# Altium schematic sheet analog_osc_front_end.SchDoc
size A3
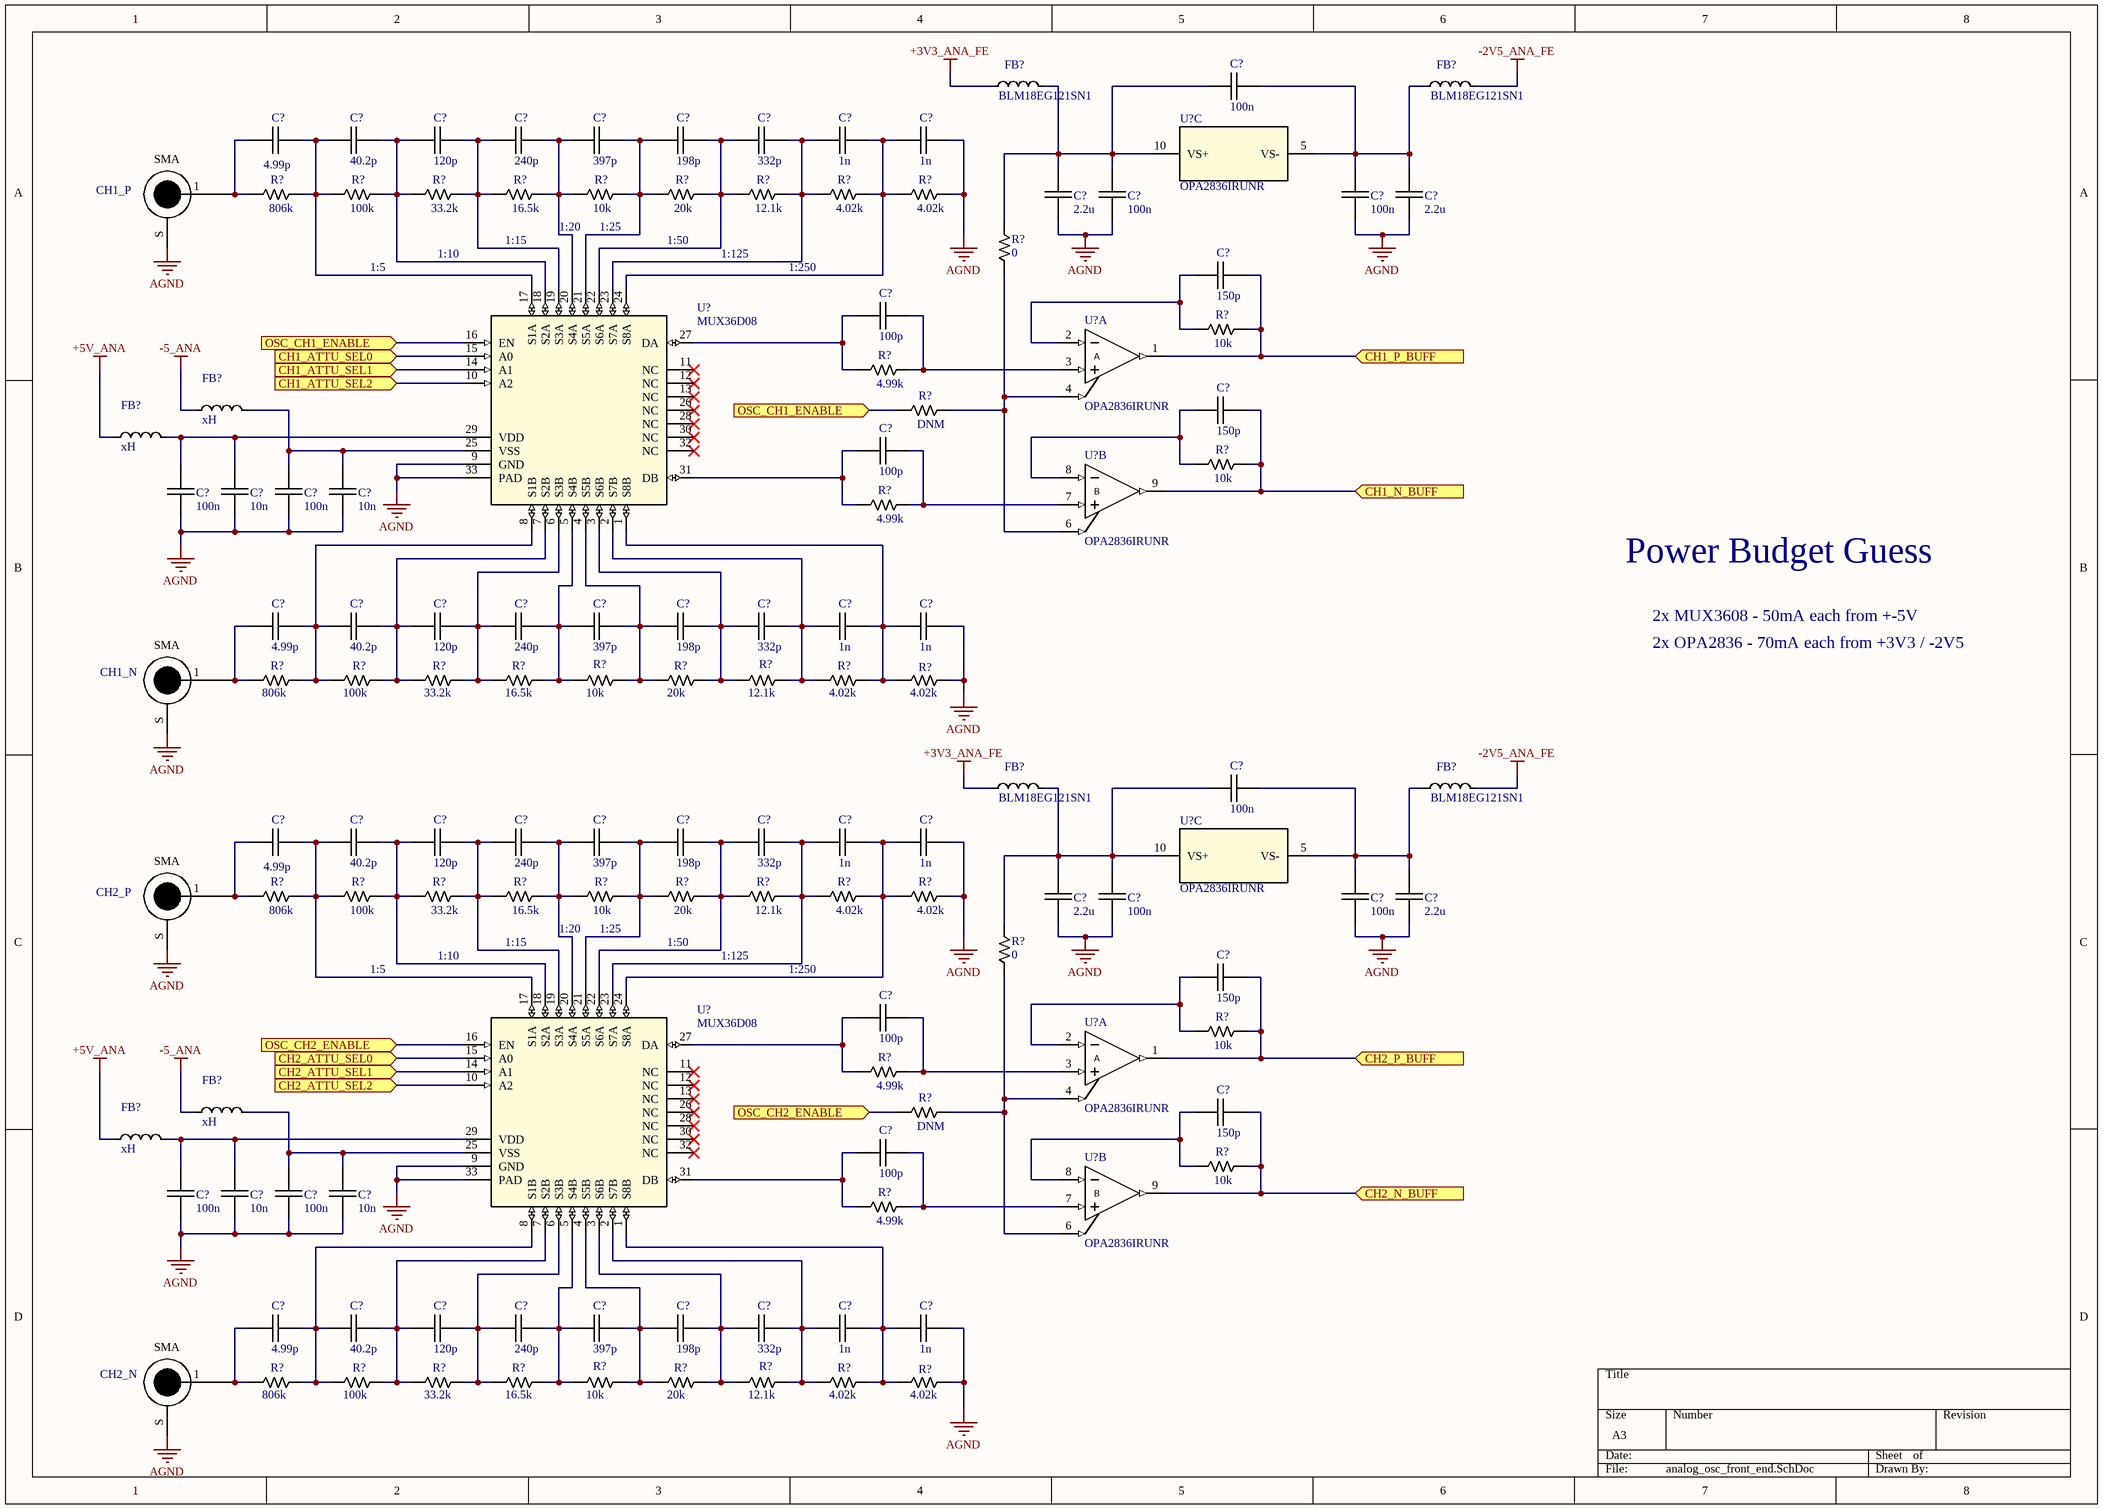
[diagram p0: analog_osc_front_end.SchDoc]

## Parts
(Parts that share a designator on the sheet are numbered #1, #2 ... from top to bottom, then left to right.)
C?#1  value 100n  [CAPC1005X06N]  (hidden comment: MLLC Capacitor)
C?#2  value 4.99p  [CAPC1005X06N]  (hidden comment: MLLC Capacitor)
C?#3  value 40.2p  [CAPC1005X06N]  (hidden comment: MLLC Capacitor)
C?#4  value 120p  [CAPC1005X06N]  (hidden comment: MLLC Capacitor)
C?#5  value 240p  [CAPC1005X06N]  (hidden comment: MLLC Capacitor)
C?#6  value 397p  [CAPC1005X06N]  (hidden comment: MLLC Capacitor)
C?#7  value 198p  [CAPC1005X06N]  (hidden comment: MLLC Capacitor)
C?#8  value 332p  [CAPC1005X06N]  (hidden comment: MLLC Capacitor)
C?#9  value 1n  [CAPC1005X06N]  (hidden comment: MLLC Capacitor)
C?#10  value 1n  [CAPC1005X06N]  (hidden comment: MLLC Capacitor)
C?#11  value 2.2u  [CAPC1005X06N]  (hidden comment: MLLC Capacitor)
C?#12  value 100n  [CAPC1005X06N]  (hidden comment: MLLC Capacitor)
C?#13  value 100n  [CAPC1005X06N]  (hidden comment: MLLC Capacitor)
C?#14  value 2.2u  [CAPC1005X06N]  (hidden comment: MLLC Capacitor)
C?#15  value 150p  [CAPC1005X06N]  (hidden comment: MLLC Capacitor)
C?#16  value 100p  [CAPC1005X06N]  (hidden comment: MLLC Capacitor)
C?#17  value 150p  [CAPC1005X06N]  (hidden comment: MLLC Capacitor)
C?#18  value 100p  [CAPC1005X06N]  (hidden comment: MLLC Capacitor)
C?#19  value 100n  [CAPC1005X06N]  (hidden comment: MLLC Capacitor)
C?#20  value 10n  [CAPC1005X06N]  (hidden comment: MLLC Capacitor)
C?#21  value 100n  [CAPC1005X06N]  (hidden comment: MLLC Capacitor)
C?#22  value 10n  [CAPC1005X06N]  (hidden comment: MLLC Capacitor)
C?#23  value 4.99p  [CAPC1005X06N]  (hidden comment: MLLC Capacitor)
C?#24  value 40.2p  [CAPC1005X06N]  (hidden comment: MLLC Capacitor)
C?#25  value 120p  [CAPC1005X06N]  (hidden comment: MLLC Capacitor)
C?#26  value 240p  [CAPC1005X06N]  (hidden comment: MLLC Capacitor)
C?#27  value 397p  [CAPC1005X06N]  (hidden comment: MLLC Capacitor)
C?#28  value 198p  [CAPC1005X06N]  (hidden comment: MLLC Capacitor)
C?#29  value 332p  [CAPC1005X06N]  (hidden comment: MLLC Capacitor)
C?#30  value 1n  [CAPC1005X06N]  (hidden comment: MLLC Capacitor)
C?#31  value 1n  [CAPC1005X06N]  (hidden comment: MLLC Capacitor)
C?#32  value 100n  [CAPC1005X06N]  (hidden comment: MLLC Capacitor)
C?#33  value 4.99p  [CAPC1005X06N]  (hidden comment: MLLC Capacitor)
C?#34  value 40.2p  [CAPC1005X06N]  (hidden comment: MLLC Capacitor)
C?#35  value 120p  [CAPC1005X06N]  (hidden comment: MLLC Capacitor)
C?#36  value 240p  [CAPC1005X06N]  (hidden comment: MLLC Capacitor)
C?#37  value 397p  [CAPC1005X06N]  (hidden comment: MLLC Capacitor)
C?#38  value 198p  [CAPC1005X06N]  (hidden comment: MLLC Capacitor)
C?#39  value 332p  [CAPC1005X06N]  (hidden comment: MLLC Capacitor)
C?#40  value 1n  [CAPC1005X06N]  (hidden comment: MLLC Capacitor)
C?#41  value 1n  [CAPC1005X06N]  (hidden comment: MLLC Capacitor)
C?#42  value 2.2u  [CAPC1005X06N]  (hidden comment: MLLC Capacitor)
C?#43  value 100n  [CAPC1005X06N]  (hidden comment: MLLC Capacitor)
C?#44  value 100n  [CAPC1005X06N]  (hidden comment: MLLC Capacitor)
C?#45  value 2.2u  [CAPC1005X06N]  (hidden comment: MLLC Capacitor)
C?#46  value 150p  [CAPC1005X06N]  (hidden comment: MLLC Capacitor)
C?#47  value 100p  [CAPC1005X06N]  (hidden comment: MLLC Capacitor)
C?#48  value 150p  [CAPC1005X06N]  (hidden comment: MLLC Capacitor)
C?#49  value 100p  [CAPC1005X06N]  (hidden comment: MLLC Capacitor)
C?#50  value 100n  [CAPC1005X06N]  (hidden comment: MLLC Capacitor)
C?#51  value 10n  [CAPC1005X06N]  (hidden comment: MLLC Capacitor)
C?#52  value 100n  [CAPC1005X06N]  (hidden comment: MLLC Capacitor)
C?#53  value 10n  [CAPC1005X06N]  (hidden comment: MLLC Capacitor)
C?#54  value 4.99p  [CAPC1005X06N]  (hidden comment: MLLC Capacitor)
C?#55  value 40.2p  [CAPC1005X06N]  (hidden comment: MLLC Capacitor)
C?#56  value 120p  [CAPC1005X06N]  (hidden comment: MLLC Capacitor)
C?#57  value 240p  [CAPC1005X06N]  (hidden comment: MLLC Capacitor)
C?#58  value 397p  [CAPC1005X06N]  (hidden comment: MLLC Capacitor)
C?#59  value 198p  [CAPC1005X06N]  (hidden comment: MLLC Capacitor)
C?#60  value 332p  [CAPC1005X06N]  (hidden comment: MLLC Capacitor)
C?#61  value 1n  [CAPC1005X06N]  (hidden comment: MLLC Capacitor)
C?#62  value 1n  [CAPC1005X06N]  (hidden comment: MLLC Capacitor)
CH1_N  SMA Edge  [SMA_EDGE]  (value not drawn)
CH1_P  SMA Edge  [SMA_EDGE]  (value not drawn)
CH2_N  SMA Edge  [SMA_EDGE]  (value not drawn)
CH2_P  SMA Edge  [SMA_EDGE]  (value not drawn)
FB?#1  value BLM18EG121SN1  [INDC1608X08N]  (hidden comment: Chip Inductor)
FB?#2  value BLM18EG121SN1  [INDC1608X08N]  (hidden comment: Chip Inductor)
FB?#3  value xH  [INDC2016X10N]  (hidden comment: Chip Inductor)
FB?#4  value xH  [INDC2016X10N]  (hidden comment: Chip Inductor)
FB?#5  value BLM18EG121SN1  [INDC1608X08N]  (hidden comment: Chip Inductor)
FB?#6  value BLM18EG121SN1  [INDC1608X08N]  (hidden comment: Chip Inductor)
FB?#7  value xH  [INDC2016X10N]  (hidden comment: Chip Inductor)
FB?#8  value xH  [INDC2016X10N]  (hidden comment: Chip Inductor)
R?#1  value 806k  [RESC1005X04N]  (hidden comment: Chip Resistor)
R?#2  value 100k  [RESC1005X04N]  (hidden comment: Chip Resistor)
R?#3  value 33.2k  [RESC1005X04N]  (hidden comment: Chip Resistor)
R?#4  value 16.5k  [RESC1005X04N]  (hidden comment: Chip Resistor)
R?#5  value 10k  [RESC1005X04N]  (hidden comment: Chip Resistor)
R?#6  value 20k  [RESC1005X04N]  (hidden comment: Chip Resistor)
R?#7  value 12.1k  [RESC1005X04N]  (hidden comment: Chip Resistor)
R?#8  value 4.02k  [RESC1005X04N]  (hidden comment: Chip Resistor)
R?#9  value 4.02k  [RESC1005X04N]  (hidden comment: Chip Resistor)
R?#10  value 0  [RESC1005X04N]  (hidden comment: Chip Resistor)
R?#11  value 10k  [RESC1005X04N]  (hidden comment: Chip Resistor)
R?#12  value 4.99k  [RESC1005X04N]  (hidden comment: Chip Resistor)
R?#13  value DNM  [RESC1005X04N]  (hidden comment: Chip Resistor)
R?#14  value 10k  [RESC1005X04N]  (hidden comment: Chip Resistor)
R?#15  value 4.99k  [RESC1005X04N]  (hidden comment: Chip Resistor)
R?#16  value 806k  [RESC1005X04N]  (hidden comment: Chip Resistor)
R?#17  value 100k  [RESC1005X04N]  (hidden comment: Chip Resistor)
R?#18  value 33.2k  [RESC1005X04N]  (hidden comment: Chip Resistor)
R?#19  value 16.5k  [RESC1005X04N]  (hidden comment: Chip Resistor)
R?#20  value 10k  [RESC1005X04N]  (hidden comment: Chip Resistor)
R?#21  value 20k  [RESC1005X04N]  (hidden comment: Chip Resistor)
R?#22  value 12.1k  [RESC1005X04N]  (hidden comment: Chip Resistor)
R?#23  value 4.02k  [RESC1005X04N]  (hidden comment: Chip Resistor)
R?#24  value 4.02k  [RESC1005X04N]  (hidden comment: Chip Resistor)
R?#25  value 806k  [RESC1005X04N]  (hidden comment: Chip Resistor)
R?#26  value 100k  [RESC1005X04N]  (hidden comment: Chip Resistor)
R?#27  value 33.2k  [RESC1005X04N]  (hidden comment: Chip Resistor)
R?#28  value 16.5k  [RESC1005X04N]  (hidden comment: Chip Resistor)
R?#29  value 10k  [RESC1005X04N]  (hidden comment: Chip Resistor)
R?#30  value 20k  [RESC1005X04N]  (hidden comment: Chip Resistor)
R?#31  value 12.1k  [RESC1005X04N]  (hidden comment: Chip Resistor)
R?#32  value 4.02k  [RESC1005X04N]  (hidden comment: Chip Resistor)
R?#33  value 4.02k  [RESC1005X04N]  (hidden comment: Chip Resistor)
R?#34  value 0  [RESC1005X04N]  (hidden comment: Chip Resistor)
R?#35  value 10k  [RESC1005X04N]  (hidden comment: Chip Resistor)
R?#36  value 4.99k  [RESC1005X04N]  (hidden comment: Chip Resistor)
R?#37  value DNM  [RESC1005X04N]  (hidden comment: Chip Resistor)
R?#38  value 10k  [RESC1005X04N]  (hidden comment: Chip Resistor)
R?#39  value 4.99k  [RESC1005X04N]  (hidden comment: Chip Resistor)
R?#40  value 806k  [RESC1005X04N]  (hidden comment: Chip Resistor)
R?#41  value 100k  [RESC1005X04N]  (hidden comment: Chip Resistor)
R?#42  value 33.2k  [RESC1005X04N]  (hidden comment: Chip Resistor)
R?#43  value 16.5k  [RESC1005X04N]  (hidden comment: Chip Resistor)
R?#44  value 10k  [RESC1005X04N]  (hidden comment: Chip Resistor)
R?#45  value 20k  [RESC1005X04N]  (hidden comment: Chip Resistor)
R?#46  value 12.1k  [RESC1005X04N]  (hidden comment: Chip Resistor)
R?#47  value 4.02k  [RESC1005X04N]  (hidden comment: Chip Resistor)
R?#48  value 4.02k  [RESC1005X04N]  (hidden comment: Chip Resistor)
U?#1  OPA2836IRUNR  [RUN0010A]  (part C of 3)
U?#2  OPA2836IRUNR  [RUN0010A]  (part A of 3)
U?#3  MUX36D08  [RTV0032E]
U?#4  OPA2836IRUNR  [RUN0010A]  (part B of 3)
U?#5  OPA2836IRUNR  [RUN0010A]  (part C of 3)
U?#6  OPA2836IRUNR  [RUN0010A]  (part A of 3)
U?#7  MUX36D08  [RTV0032E]
U?#8  OPA2836IRUNR  [RUN0010A]  (part B of 3)

## Ports
CH1_ATTU_SEL0 (in), CH1_ATTU_SEL1 (in), CH1_ATTU_SEL2 (in), CH1_N_BUFF (in), CH1_P_BUFF (in), CH2_ATTU_SEL0 (in), CH2_ATTU_SEL1 (in), CH2_ATTU_SEL2 (in), CH2_N_BUFF (in), CH2_P_BUFF (in), OSC_CH1_ENABLE (in), OSC_CH2_ENABLE (in)

## Nets
+3V3_ANA_FE: FB?#1.1 FB?#5.1
+5V_ANA: FB?#4.1 FB?#8.1
-2V5_ANA_FE: FB?#2.2 FB?#6.2
-5_ANA: FB?#3.1 FB?#7.1
AGND: C?#10.2 C?#11.1 C?#12.1 C?#13.1 C?#14.1 C?#19.1 C?#20.1 C?#21.1 C?#22.1 C?#31.2 C?#41.2 C?#42.1 C?#43.1 C?#44.1 C?#45.1 C?#50.1 C?#51.1 C?#52.1 C?#53.1 C?#62.2 CH1_N.S CH1_P.S CH2_N.S CH2_P.S R?#9.2 R?#24.2 R?#33.2 R?#48.2 U?#3.9(GND) U?#3.33(PAD) U?#7.9(GND) U?#7.33(PAD)
CH1_ATTU_SEL0: U?#3.15(A0) ; port CH1_ATTU_SEL0
CH1_ATTU_SEL1: U?#3.14(A1) ; port CH1_ATTU_SEL1
CH1_ATTU_SEL2: U?#3.10(A2) ; port CH1_ATTU_SEL2
CH1_N_BUFF: C?#17.2 R?#14.2 U?#4.9(VOUT2) ; port CH1_N_BUFF
CH1_P_BUFF: C?#15.2 R?#11.2 U?#2.1(VOUT1) ; port CH1_P_BUFF
CH2_ATTU_SEL0: U?#7.15(A0) ; port CH2_ATTU_SEL0
CH2_ATTU_SEL1: U?#7.14(A1) ; port CH2_ATTU_SEL1
CH2_ATTU_SEL2: U?#7.10(A2) ; port CH2_ATTU_SEL2
CH2_N_BUFF: C?#48.2 R?#38.2 U?#8.9(VOUT2) ; port CH2_N_BUFF
CH2_P_BUFF: C?#46.2 R?#35.2 U?#6.1(VOUT1) ; port CH2_P_BUFF
OSC_CH1_ENABLE: R?#13.1 U?#3.16(EN) ; port OSC_CH1_ENABLE
OSC_CH2_ENABLE: R?#37.1 U?#7.16(EN) ; port OSC_CH2_ENABLE
NetC?#1_1: C?#1.1 C?#13.2 C?#14.2 FB?#2.1 U?#1.5(VS-)
NetC?#1_2: C?#1.2 C?#11.2 C?#12.2 FB?#1.2 R?#10.2 U?#1.10(VS+)
NetC?#2_1: C?#2.1 CH1_P.1(FEED) R?#1.1
NetC?#2_2: C?#2.2 C?#3.1 R?#1.2 R?#2.1 U?#3.17(S1A)
NetC?#3_2: C?#3.2 C?#4.1 R?#2.2 R?#3.1 U?#3.18(S2A)
NetC?#4_2: C?#4.2 C?#5.1 R?#3.2 R?#4.1 U?#3.19(S3A)
NetC?#5_2: C?#5.2 C?#6.1 R?#4.2 R?#5.1 U?#3.20(S4A)
NetC?#6_2: C?#6.2 C?#7.1 R?#5.2 R?#6.1 U?#3.21(S5A)
NetC?#7_2: C?#7.2 C?#8.1 R?#6.2 R?#7.1 U?#3.22(S6A)
NetC?#8_2: C?#8.2 C?#9.1 R?#7.2 R?#8.1 U?#3.23(S7A)
NetC?#9_2: C?#9.2 C?#10.1 R?#8.2 R?#9.1 U?#3.24(S8A)
NetC?#15_1: C?#15.1 R?#11.1 U?#2.2(IN-)
NetC?#16_1: C?#16.1 R?#12.1 U?#3.27(DA)
NetC?#16_2: C?#16.2 R?#12.2 U?#2.3(IN+)
NetC?#17_1: C?#17.1 R?#14.1 U?#4.8(IN-)
NetC?#18_1: C?#18.1 R?#15.1 U?#3.31(DB)
NetC?#18_2: C?#18.2 R?#15.2 U?#4.7(IN+)
NetC?#19_2: C?#19.2 C?#20.2 FB?#4.2 U?#3.29(VDD)
NetC?#21_2: C?#21.2 C?#22.2 FB?#3.2 U?#3.25(VSS)
NetC?#23_1: C?#23.1 CH1_N.1(FEED) R?#16.1
NetC?#23_2: C?#23.2 C?#24.1 R?#16.2 R?#17.1 U?#3.8(S1B)
NetC?#24_2: C?#24.2 C?#25.1 R?#17.2 R?#18.1 U?#3.7(S2B)
NetC?#25_2: C?#25.2 C?#26.1 R?#18.2 R?#19.1 U?#3.6(S3B)
NetC?#26_2: C?#26.2 C?#27.1 R?#19.2 R?#20.1 U?#3.5(S4B)
NetC?#27_2: C?#27.2 C?#28.1 R?#20.2 R?#21.1 U?#3.4(S5B)
NetC?#28_2: C?#28.2 C?#29.1 R?#21.2 R?#22.1 U?#3.3(S6B)
NetC?#29_2: C?#29.2 C?#30.1 R?#22.2 R?#23.1 U?#3.2(S7B)
NetC?#30_2: C?#30.2 C?#31.1 R?#23.2 R?#24.1 U?#3.1(S8B)
NetC?#32_1: C?#32.1 C?#44.2 C?#45.2 FB?#6.1 U?#5.5(VS-)
NetC?#32_2: C?#32.2 C?#42.2 C?#43.2 FB?#5.2 R?#34.2 U?#5.10(VS+)
NetC?#33_1: C?#33.1 CH2_P.1(FEED) R?#25.1
NetC?#33_2: C?#33.2 C?#34.1 R?#25.2 R?#26.1 U?#7.17(S1A)
NetC?#34_2: C?#34.2 C?#35.1 R?#26.2 R?#27.1 U?#7.18(S2A)
NetC?#35_2: C?#35.2 C?#36.1 R?#27.2 R?#28.1 U?#7.19(S3A)
NetC?#36_2: C?#36.2 C?#37.1 R?#28.2 R?#29.1 U?#7.20(S4A)
NetC?#37_2: C?#37.2 C?#38.1 R?#29.2 R?#30.1 U?#7.21(S5A)
NetC?#38_2: C?#38.2 C?#39.1 R?#30.2 R?#31.1 U?#7.22(S6A)
NetC?#39_2: C?#39.2 C?#40.1 R?#31.2 R?#32.1 U?#7.23(S7A)
NetC?#40_2: C?#40.2 C?#41.1 R?#32.2 R?#33.1 U?#7.24(S8A)
NetC?#46_1: C?#46.1 R?#35.1 U?#6.2(IN-)
NetC?#47_1: C?#47.1 R?#36.1 U?#7.27(DA)
NetC?#47_2: C?#47.2 R?#36.2 U?#6.3(IN+)
NetC?#48_1: C?#48.1 R?#38.1 U?#8.8(IN-)
NetC?#49_1: C?#49.1 R?#39.1 U?#7.31(DB)
NetC?#49_2: C?#49.2 R?#39.2 U?#8.7(IN+)
NetC?#50_2: C?#50.2 C?#51.2 FB?#8.2 U?#7.29(VDD)
NetC?#52_2: C?#52.2 C?#53.2 FB?#7.2 U?#7.25(VSS)
NetC?#54_1: C?#54.1 CH2_N.1(FEED) R?#40.1
NetC?#54_2: C?#54.2 C?#55.1 R?#40.2 R?#41.1 U?#7.8(S1B)
NetC?#55_2: C?#55.2 C?#56.1 R?#41.2 R?#42.1 U?#7.7(S2B)
NetC?#56_2: C?#56.2 C?#57.1 R?#42.2 R?#43.1 U?#7.6(S3B)
NetC?#57_2: C?#57.2 C?#58.1 R?#43.2 R?#44.1 U?#7.5(S4B)
NetC?#58_2: C?#58.2 C?#59.1 R?#44.2 R?#45.1 U?#7.4(S5B)
NetC?#59_2: C?#59.2 C?#60.1 R?#45.2 R?#46.1 U?#7.3(S6B)
NetC?#60_2: C?#60.2 C?#61.1 R?#46.2 R?#47.1 U?#7.2(S7B)
NetC?#61_2: C?#61.2 C?#62.1 R?#47.2 R?#48.1 U?#7.1(S8B)
NetR?#10_1: R?#10.1 R?#13.2 U?#2.4(PD1_N) U?#4.6(PD2_N)
NetR?#34_1: R?#34.1 R?#37.2 U?#6.4(PD1_N) U?#8.6(PD2_N)

Not connected (* = marked no-connect by the designer): U?#3 11(NC)* 12(NC)* 13(NC)* 26(NC)* 28(NC)* 30(NC)* 32(NC)*; U?#7 11(NC)* 12(NC)* 13(NC)* 26(NC)* 28(NC)* 30(NC)* 32(NC)*

## Notes on the sheet
- (near R?#4) 1:15
- (near R?#5) 1:20
- (near R?#5) 1:25
- (near R?#6) 1:50
- 1:5
- 1:10
- 1:125
- 1:250
- Power Budget Guess
- 2x MUX3608 - 50mA each from +-5V
- 2x OPA2836 - 70mA each from +3V3 / -2V5
- (near R?#28) 1:15
- (near R?#29) 1:20
- (near R?#29) 1:25
- (near R?#30) 1:50
- (in symbol OPA2836IRUNR, part A) A
- (in symbol OPA2836IRUNR, part B) B
- (in symbol SMA Edge) SMA

## Library data of the parts
C?#1-C?#62 = Cap: Rating: *
CH1_N CH1_P CH2_N CH2_P = SMA Edge: Right Angle Edge Connector 1.6mm
FB?#1-FB?#8 = Ind
R?#1-R?#48 = Res
U?#1 U?#2 U?#4-U?#6 U?#8 = OPA2836IRUNR: Dual, Very Low Power, Rail to Rail out, Negative Rail in, VFB Op Amp, 205MHz BW, 120 MHz GBW; Manufacturer: Texas Instruments; PartNumber: OPA2836IRUNR; RefDes: RefDes; Type: DEV; Value: Value; Copyright: Copyright (C) 2018 Accelerated Designs. All rights reserved; ComponentLink1Description: Product Page; ComponentLink1URL: https://www.ti.com/product/OPA2836
U?#3 U?#7 = MUX36D08: 1-pA on-state leakage current, 36-V,dual 8:1, precision analog multiplexer; Manufacturer: Texas Instruments; PartNumber: MUX36D08IRTVR; RefDes: RefDes; Type: DEV; Value: Value; Copyright: Copyright (C) 2018 Accelerated Designs. All rights reserved; ComponentLink1Description: Product Page; ComponentLink1URL: https://www.ti.com/product/MUX36D08